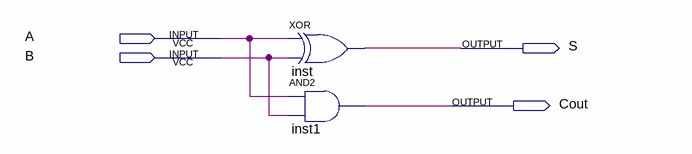
[diagram p0: schematic sheet]
// Quartus schematic HA_rca.bdf as structural Verilog: 2 symbols, 4 pins
module HA_rca (
  input  A,
  input  B,
  output S,
  output Cout
);

  xor inst (S, A, B);
  and inst1 (Cout, A, B);
endmodule
